# Altium schematic sheet Ch_IbVg.schdoc
size 444 x 187 mm
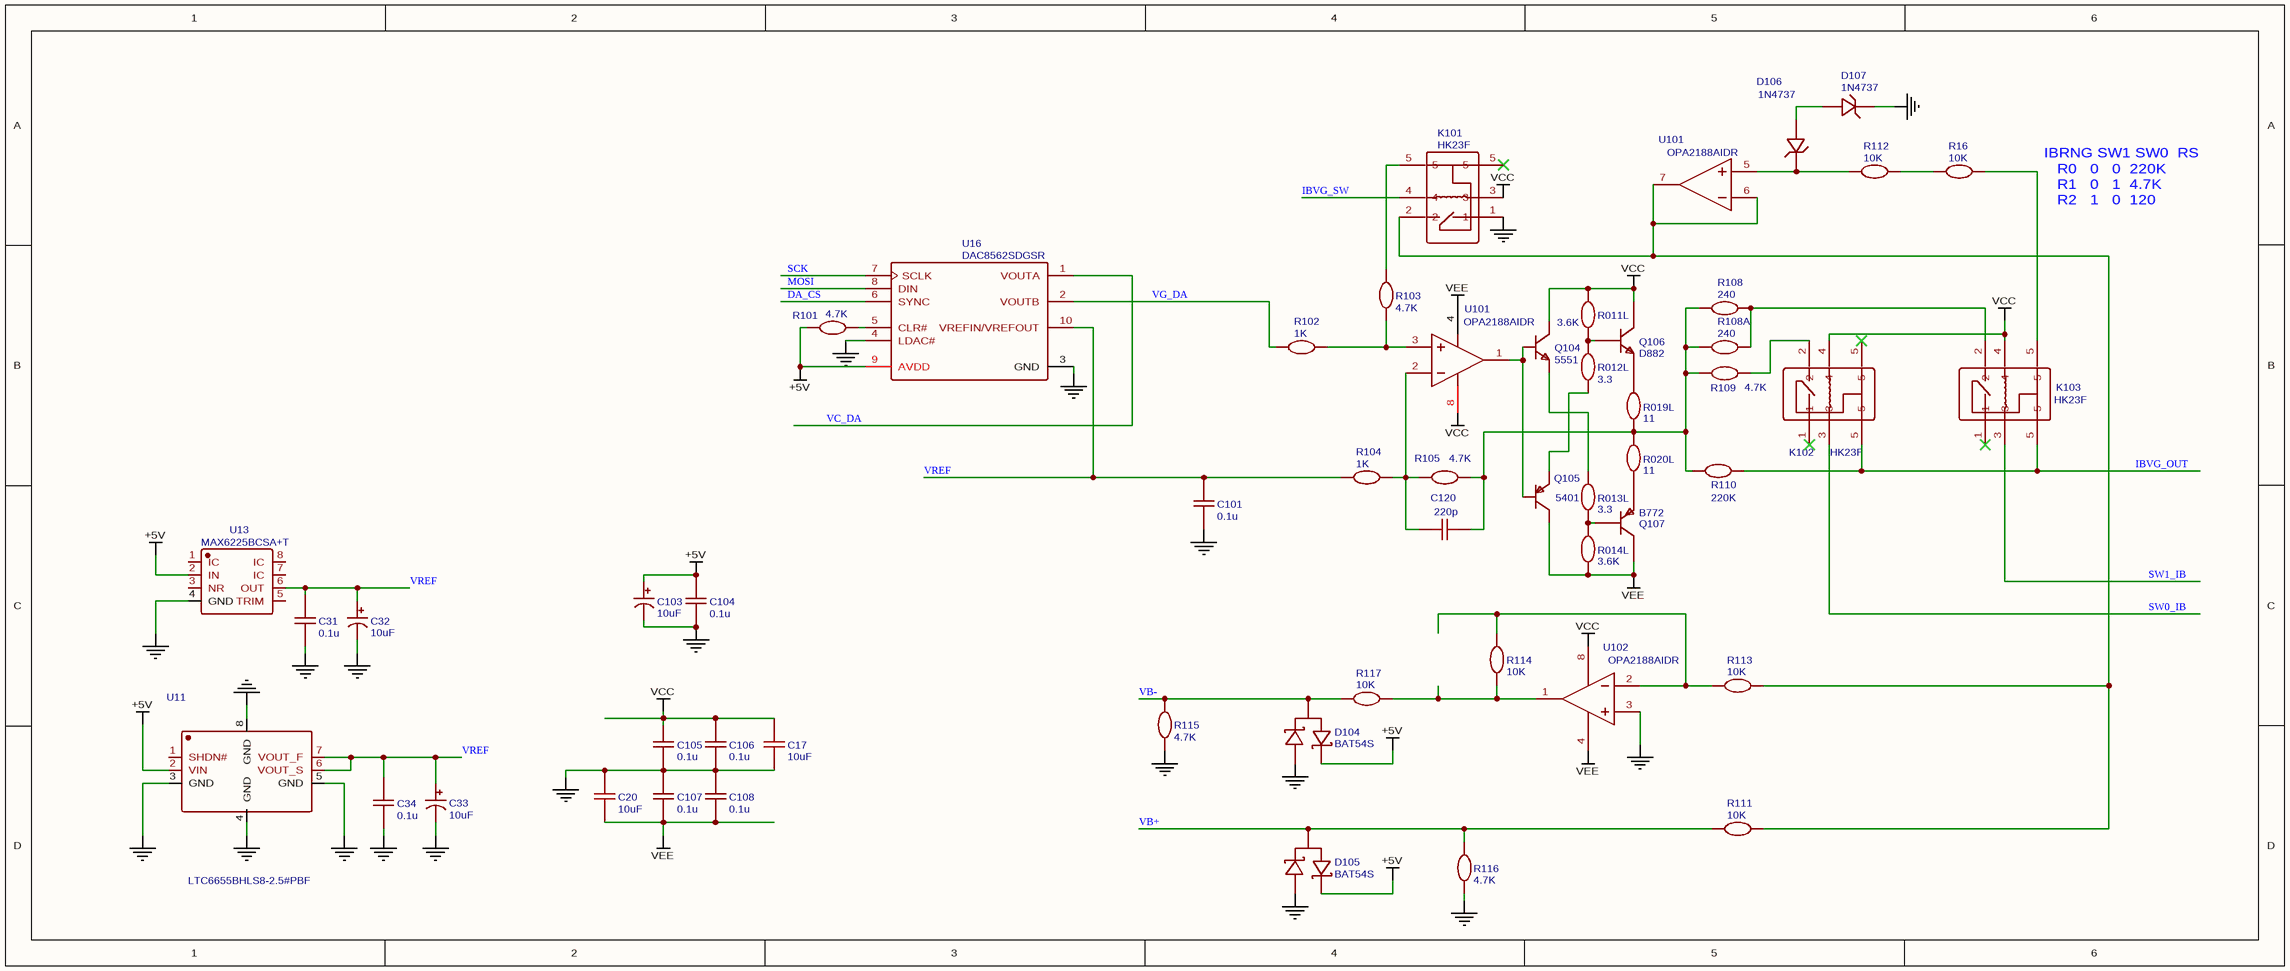
[diagram p0: Ch_IbVg.schdoc]

## Parts
(Parts that share a designator on the sheet are numbered #1, #2 ... from top to bottom, then left to right.)
C17  10uF  [C0805]
C20  10uF  [C0805]
C31  0.1u  [C0805]
C32  10uF  [C0805]
C33  10uF  [C0805]
C34  0.1u  [C0805]
C101  0.1u  [C0805]
C103  10uF  [C0805]
C104  0.1u  [C0805]
C105  0.1u  [C0805]
C106  0.1u  [C0805]
C107  0.1u  [C0805]
C108  0.1u  [C0805]
C120  220p  [C0805]
D104  BAT54S  [SOT-23(SOT-23-3)]
D105  BAT54S  [SOT-23(SOT-23-3)]
D106  1N4737  [SMA_L4.4-W2.6-LS5.0-RD]
D107  1N4737  [SMA_L4.4-W2.6-LS5.0-RD]
K101  HK23F  [HK23F-DC12V-SH]
K102  HK23F  [HK23F-DC12V-SH]
K103  HK23F  [HK23F-DC12V-SH]
Q104  5551  [SOT-23-3_L2.9-W1.3-P1.90-LS2.4-BR]
Q105  5401  [SOT-23-3_L2.9-W1.3-P1.90-LS2.4-BR]
Q106  D882  [SOT-89-3_L4.5-W2.5-P1.50-LS4.2-BR]
Q107  B772  [SOT-89-3_L4.5-W2.5-P1.50-LS4.2-BR]
R011L  3.6K  [R0805]
R012L  3.3  [R0805]
R013L  3.3  [R0805]
R014L  3.6K  [R0805]
R16  10K  [R0805_NEW]
R019L  11  [R0805]
R020L  11  [R0805]
R101  4.7K  [R0805_NEW]
R102  1K  [R0805_NEW]
R103  4.7K  [R0805_NEW]
R104  1K  [R0805_NEW]
R105  4.7K  [R0805_NEW]
R108  240  [R1206]
R108A  240  [R1206]
R109  4.7K  [R1206]
R110  220K  [R1206]
R111  10K  [R0805_NEW]
R112  10K  [R0805_NEW]
R113  10K  [R0805_NEW]
R114  10K  [R0805_NEW]
R115  4.7K  [R0805_NEW]
R116  4.7K  [R0805_NEW]
R117  10K  [R0805_NEW]
U11  LTC6655BHLS8-2.5#PBF  [LCC-8_L5.0-W5.0-P1.27-BL]
U13  MAX6225BCSA+T  [SOP-8_L4.9-W3.9-P1.27-LS6.0-BL]
U16  DAC8562SDGSR  [VSSOP-10_10PIN-L3.10-W5.05-PITCH0.50-TL]
U101#1  OPA2188AIDR  [SOIC-8_L4.9-W3.9-P1.27-LS6.0-BL]
U101#2  OPA2188AIDR  [SOIC-8_L4.9-W3.9-P1.27-LS6.0-BL]
U102  OPA2188AIDR  [SOIC-8_L4.9-W3.9-P1.27-LS6.0-BL]

## Nets
+5V: C103.1 C104.2 D104.2(K2) D105.2(K2) R101.1 U11.2(VIN) U13.2(IN) U16.9(AVDD)
GND: C17.1 C20.2 C31.1 C32.2 C33.2 C34.1 C101.1 C103.2 C104.1 C105.1 C106.1 C107.2 C108.2 D104.1(A1) D105.1(A1) D107.1(C) K101.1 R115.2 R116.2 U11.3(GND) U11.4(GND) U11.5(GND) U11.8(GND) U13.4(GND) U16.3(GND) U16.4(LDAC#) U102.3(IN_A+)
VCC: C17.2 C105.2 C106.2 K101.3 K102.4 K103.4 Q104.3(C) Q106.2(C) R011L.1 U101#2.8(V+) U102.8(V+)
VEE: C20.1 C107.1 C108.1 Q105.3(C) Q107.2(C) R014L.1 U101#2.4(V-) U102.4(V-)
DA_CS: U16.6(SYNC)
IBVG_OUT: K102.5 K103.5 R110.2
IBVG_SW: K101.4
MOSI: U16.8(DIN)
SCK: U16.7(SCLK)
SW0_IB: K102.3
SW1_IB: K103.3
VB+: D105.3(A) R111.2 R116.1
VB-: D104.3(A) R115.1 R117.2
VC_DA: U16.1(VOUTA)
VG_DA: R102.2 U16.2(VOUTB)
VREF: C31.2 C32.1 C33.1 C34.2 C101.2 R104.2 U11.6(VOUT_S) U11.7(VOUT_F) U13.6(OUT) U16.10(VREFIN/VREFOUT)
NetC120_1: C120.1 R019L.1 R020L.2 R105.2 R108.1 R108A.1 R109.1 R110.1
NetC120_2: C120.2 R104.1 R105.1 U101#2.2(IN_A-)
NetD106_1: D106.1(C) R112.1 U101#1.5(IN_B+)
NetD106_2: D106.2(A) D107.2(A)
NetK101_2: K101.2 R111.1 R113.1 U101#1.6(IN_B-) U101#1.7(OUT_B)
NetK101_5: K101.5 R103.2
NetK102_2: K102.2 R109.2
NetK103_2: K103.2 R108.2 R108A.2
NetK103_5: K103.5 R16.2
NetQ104_1: Q104.1(B) Q105.1(B) U101#2.1(OUT_A)
NetQ104_2: Q104.2(E) R013L.2
NetQ105_2: Q105.2(E) R012L.2
NetQ106_1: Q106.1(B) R011L.2 R012L.1
NetQ106_3: Q106.3(E) R019L.2
NetQ107_1: Q107.1(B) R013L.1 R014L.2
NetQ107_3: Q107.3(E) R020L.1
NetR16_1: R16.1 R112.2
NetR101_2: R101.2 U16.5(CLR#)
NetR102_1: R102.1 R103.1 U101#2.3(IN_A+)
NetR113_2: R113.2 R114.2 U102.2(IN_A-)
NetR114_1: R114.1 R117.1 U102.1(OUT_A)

Not connected (* = marked no-connect by the designer): K102 1*; K103 1*; U11 1(SHDN#); U13 1(IC) 3(NR) 5(TRIM) 7(IC) 8(IC)

## Notes on the sheet
- IBRNG SW1 SW0  RS
  R0   0   0  220K
  R1   0   1  4.7K
  R2   1   0  120

## Library data of the parts
C17 C20 = 10uF: nameAlias: Value(F); spicePre: C; spiceSymbolName: Cap_0805_US
C31 C34 C101 C104-C108 = 0.1u: nameAlias: Value(F); spicePre: C; spiceSymbolName: Cap_0805_US
C32 C33 C103 = 10uF: BOM_Manufacturer: ValuePro; BOM_Manufacturer Part: 10uF 16V 3*5; nameAlias: Capacitance; BOM_Supplier: LCSC; BOM_Supplier Part: C43798; spicePre: C; spiceSymbolName: 10uF 16V 3*5
C120 = 220p: nameAlias: Value(F); spicePre: C; spiceSymbolName: Cap_0805_US
D104 D105 = BAT54S: BOM_Manufacturer: SEMTECH; SMT Type: Extend; BOM_Supplier: LCSC; BOM_Manufacturer Part: BAT54S; image: //image.lceda.cn/szlcsc/C83935.jpg; BOM_Supplier Part: C83935; BOM_LCSC Assembly: Yes; spicePre: D
D106 D107 = 1N4737: BOM_Manufacturer: 1SMA4742A; BOM_Manufacturer Part: 1N4743A-G; Contributor: LCSC; BOM_Supplier: LCSC; BOM_Supplier Part: C268415; spicePre: D; spiceSymbolName: 1N4743A-G
K101-K103 = HK23F: BOM_Manufacturer: HUIKE; BOM_Manufacturer Part: HK23F-DC12V-SHG; BOM_Supplier: LCSC; image: //image.lceda.cn/szlcsc/C39333.jpg; BOM_Supplier Part: C39333; spicePre: K
Q104 = 5551: BOM_Manufacturer Part: MMBT5550; BOM_Manufacturer: LGE; Contributor: LCSC; BOM_Supplier: LCSC; BOM_Supplier Part: C402304; spicePre: Q
Q105 = 5401: BOM_Manufacturer Part: MMBT5401; BOM_Manufacturer: Yangzhou Yangjie Elec Tech; Contributor: LCSC; BOM_Supplier: LCSC; BOM_Supplier Part: C405310; spicePre: Q
Q106 = D882: BOM_Manufacturer: BLUE ROCKET; BOM_Manufacturer Part: 2SD882T-P; Contributor: LCSC; BOM_Supplier: LCSC; BOM_Supplier Part: C305479; BOM_JLCPCB Part Class: Extended Part; spicePre: Q; spiceSymbolName: 2SD882T-P
Q107 = B772: BOM_Manufacturer: BLUE ROCKET; BOM_Manufacturer Part: 2SB772T-P; Contributor: LCSC; BOM_Supplier: LCSC; BOM_Supplier Part: C305448; BOM_JLCPCB Part Class: Extended Part; spicePre: Q; spiceSymbolName: 2SB772T-P
R011L R014L = 3.6K: nameAlias: Value(Ω); Contributor: LCEDA_Lib; spicePre: R; spiceSymbolName: R_0603_EU
R012L R013L = 3.3: nameAlias: Value(Ω); Contributor: LCEDA_Lib; spicePre: R; spiceSymbolName: R_0603_EU
R16 R111-R114 R117 = 10K: nameAlias: Value(Ω); spicePre: R; spiceSymbolName: Res_0805(1/8W)_EU
R019L R020L = 11: nameAlias: Value(Ω); Contributor: LCEDA_Lib; spicePre: R; spiceSymbolName: R_0603_EU
R101 R103 R105 R109 R115 R116 = 4.7K: nameAlias: Value(Ω); spicePre: R; spiceSymbolName: Res_0805(1/8W)_EU
R102 R104 = 1K: nameAlias: Value(Ω); spicePre: R; spiceSymbolName: Res_0805(1/8W)_EU
R108 R108A = 240: nameAlias: Value(Ω); spicePre: R; spiceSymbolName: Res_0805(1/8W)_EU
R110 = 220K: nameAlias: Value(Ω); spicePre: R; spiceSymbolName: Res_0805(1/8W)_EU
U11 = LTC6655BHLS8-2.5#PBF: BOM_Manufacturer: LINEAR; BOM_Supplier: LCSC; BOM_Manufacturer Part: LTC6655BHLS8-2.5#PBF; BOM_Supplier Part: C107982; BOM_JLCPCB Part Class: Extended Part; spicePre: U; spiceSymbolName: LTC6655BHLS8-2.5#PBF
U13 = MAX6225BCSA+T: BOM_Manufacturer: Maxim Integrated; Contributor: LCSC; BOM_Supplier: LCSC; BOM_Supplier Part: C559512; BOM_Manufacturer Part: MAX6225BCSA+T; BOM_JLCPCB Part Class: Extended Part; spicePre: U; spiceSymbolName: MAX6225BCSA+T
U16 = DAC8562SDGSR: BOM_Manufacturer: TI; Contributor: LCSC; SMT Type: Extend; BOM_Supplier: LCSC; BOM_Manufacturer Part: DAC8562SDGSR; BOM_Supplier Part: C127965; BOM_LCSC Assembly: Yes; spicePre: U; spiceSymbolName: DAC8562SDGSR
U101#1 U101#2 = OPA2188AIDR: BOM_Manufacturer: TI; subpart_no: 1; tags: Precision Operational Amplifier; BOM_Supplier Part: C17271; BOM_Supplier: LCSC; BOM_Manufacturer Part: OPA2188AIDR; image: http://image.lceda.cn/szlcsc/C17271.jpg; spicePre: U; spiceSymbolName: OPA2188AIDR
U102 = OPA2188AIDR: BOM_Manufacturer: TI; subpart_no: 2; tags: Precision Operational Amplifier; BOM_Supplier Part: C17271; BOM_Supplier: LCSC; BOM_Manufacturer Part: OPA2188AIDR; image: http://image.lceda.cn/szlcsc/C17271.jpg; spicePre: U